# EasyEDA Pro project ProPrj_HEMY 2.0_2025-04-23.epro, board HEMY Brake Driver 1.1
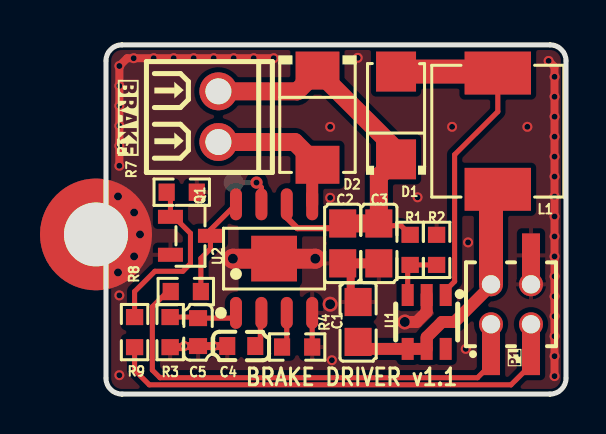
[diagram p6: board, top side]
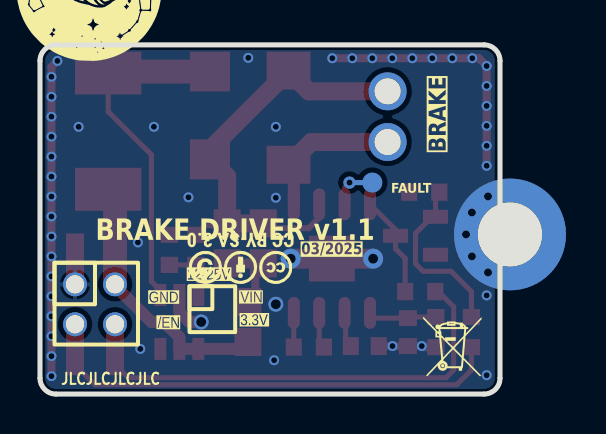
[diagram p7: board, bottom side, seen from below]

Outline 23 x 17.5 mm; copper layers: Top Layer, Bottom Layer. Coordinates in mm from the lower left corner of the outline.
Outline path: 0,16.7 0,0.8 arc(0.23,0.23) 0.8,0 22.2,0 arc(22.77,0.23) 23,0.8 23,16.7 arc(22.77,17.27) 22.2,17.5 0.8,17.5 arc(0.23,17.27) 0,16.7
Stack: Top Layer 0.035mm / Dielectric1 0.71mm FR4 er 4.5 / Bottom Layer 0.035mm

## Design rules (mm)
template: Custom Config
spacing copperThickness1oz (default): track to track 0.102, other pairs 0.15 to 0.3
spacing copperThickness2oz: track to track 0.203, other pairs 0.152 to 0.3
track width copperThickness1oz (default): min 0.127, default 0.254, max 2.54
track width copperThickness2oz: min 0.203, default 0.254, max 2.54
differential pair differentialPair (default): width min 0.127, default 0.254, max 2.54; gap min 0.152, default 0.152
via viaSize (default): diameter min 0.5, default 0.61, max 10; hole min 0.25, default 0.305, max 6.3

## Placement (name value [footprint] x y rotation side)
C1  22uF  [C0805]  12.6 3.61 270 top
C2  100nF  [C0805]  11.84 7.55 270 top
C3  22uF  [C0805]  13.64 7.55 90 top
C4  100nF  [C0603]  6.76 2.41 0 top
C5  100pF  [C0603]  4.6 3.11 90 top
D1  SS34  [SMA_L4.3-W2.6-LS5.2-RD]  14.5 13.96 90 top
D2  ES3DB  [SMB_L4.6-W3.6-LS5.3-RD]  10.57 13.85 270 top
FAULT  -  [Test-Point-0.5mm]  6.38 10.6 180 bottom
L1  22uH  [IND-SMD_L7.1-W6.6]  19.59 13.17 90 top
NOREF  -  [Pad_e8820]  -0.5 8 0 top
P1  -  [62100421821]  20.25 4.5 0 top
P3  MX128-2.54-02P  [CONN-TH_2P-P2.54_MX128-2.54-GN01-02P-CU-Y-A]  5.62 13.9 270 top
Q1  MMBT3904  [SOT-23-3_L2.9-W1.3-P1.90-LS2.4-BR]  4.22 7.93 180 top
R1  82kΩ  [R0603]  15.21 7.23 270 top
R2  2.2kΩ  [R0603]  16.53 7.23 270 top
R3  33kΩ  [R0603]  3.21 3.11 90 top
R4  47kΩ  [R0603]  9.56 2.36 180 top
R7  4.7kΩ  [R0603]  3.79 10.12 180 top
R8  4.7kΩ  [R0603]  3.99 5.14 180 top
R9  4.7kΩ  [R0603]  1.43 3.11 90 top
U1  SDB628  [SOT-23-6_L2.9-W1.6-P0.95-LS2.8-BR]  16.03 3.61 90 top
U2  DRV103H/2K5  [SOIC-8_L4.9-W3.9-P1.27-LS6.0-BL-EP2.3]  8.4 6.79 0 top

## Footprints (pads in the part's own frame, mm; a bottom-side part is the same pattern mirrored in y, then rotated)
62100421821
  round 1.2 hole 0.914x0.85: 1(-1,-1) 2(-1,1) 3(1,-1) 4(1,1)
  rect 0.9x2.2 smd: 1(-1,-2.45) 2(-1,2.45) 3(1,-2.45) 4(1,2.45)
C0603
  rect 0.8x0.9 smd: 1(-0.7,0) 2(0.7,0)
C0805
  rect 1.41x1.35 smd: 1(-1,0) 2(1,0)
CONN-TH_2P-P2.54_MX128-2.54-GN01-02P-CU-Y-A
  round 1.9 hole 1.3: 1(-1.27,0) 2(1.27,0)
IND-SMD_L7.1-W6.6
  rect 2.15x3.32 smd: 1(-2.913,0) 2(2.913,0)
Pad_e8820
  round 5.6 hole 3.2: 1(0,0)
R0603
  rect 0.806x0.864 smd: 1(-0.753,0) 2(0.753,0)
SMA_L4.3-W2.6-LS5.2-RD
  rect 2x2 smd: 1(-2.2,0) 2(2.2,0)
SMB_L4.6-W3.6-LS5.3-RD
  rect 1.9x2.192 smd: 1(-2.361,0) 2(2.361,0)
SOIC-8_L4.9-W3.9-P1.27-LS6.0-BL-EP2.3
  oval 0.6x1.6 smd: 1(-1.905,-2.72) 2(-0.635,-2.72) 3(0.635,-2.72) 4(1.905,-2.72) 5(1.905,2.72) 6(0.635,2.72) 7(-0.635,2.72) 8(-1.905,2.72)
  rect 2.29x2.29 smd: 9(0,0)
SOT-23-3_L2.9-W1.3-P1.90-LS2.4-BR
  rect 1.25x0.7 smd: 1(1,-0.95) 2(1,0.95) 3(-1,0)
SOT-23-6_L2.9-W1.6-P0.95-LS2.8-BR
  rect 1.1x0.6 smd: 1(1.35,-0.95) 2(1.35,0) 3(1.35,0.95) 4(-1.35,0.95) 5(-1.35,0) 6(-1.35,-0.95)
Test-Point-0.5mm
  round 1 smd: 1(0,0)

## Nets
As in the schematic, except:
GND: C1.1 C2.2 C3.1 C4.1 C5.1 NOREF.1 P1.4 Q1.2 R2.1 R3.1 R4.1 R7.1 U1.2 U2.4 U2.9
$1N4182: D2.2 P3.2 U2.5

Pads without a net: U1 6

## Via types
v1: diameter 0.5, hole 0.3, Top Layer to Bottom Layer, 44 vias
v2: diameter 0.75, hole 0.5, Top Layer to Bottom Layer, 2 vias
v3: diameter 0.5, hole 0.4, Top Layer to Bottom Layer, 5 vias
v4: diameter 1, hole 0.5, Top Layer to Bottom Layer, 2 vias
v5: diameter 0.61, hole 0.305, Top Layer to Bottom Layer, 1 via

## Routing (per net, layer and track width the routed paths; a pad name or vN(x,y) marks a point on that pad's centre or on a via; arc(x,y) is an arc through that point)
3.3V: length 22.3
  Top Layer w0.254: P1.1 19.25,1.5 18.57,0.82 2.7,0.82 2.32,1.2 2.32,4.38 3.08,5.14 R8.2
24V: length 22.4
  Top Layer w0.254: R1.1 14.75,8.44 13.75,8.44 C3.2
  Top Layer w0.3: C2.1 11.6,8.31 9.57,8.31 9.04,8.84 U2.6
  Top Layer w0.9: 10.57,16.19 9.56,15.17 5.62,15.17 ; 10.57,16.19 14.5,12.26 14.5,11.76 13.64,10.9 C3.2 C2.1 ; 10.57,16.19 D2.1
GND: length 43.9
  Top Layer w0.254: 10.31,2.36 U2.4
  Top Layer w0.4: C5.1 6.06,2.41 ; 4.6,2.41 v1(3.91,2.41) 3.86,2.35 R3.1 ; v1(0.67,11.44) v1(0.67,12.44) v1(0.67,13.44) v1(0.67,14.44) v1(0.67,15.44) v1(0.67,16.44) 1.06,16.83 v1(1.38,16.83) v1(2.38,16.83) v1(3.38,16.83) v1(4.38,16.83) v1(5.38,16.83) v1(6.38,16.83) v1(7.38,16.83) v1(8.38,16.83) ; C1.1 12.49,4.73 12.24,4.73 12.24,6.15 C2.2 ; v1(22.13,16.69) 22.43,16.4 v1(22.43,15.9) v1(22.43,14.9) v1(22.43,13.9) v1(22.43,12.9) v1(22.43,11.9) v1(22.43,10.9) v1(22.43,9.9) v1(22.43,8.9) v1(22.43,7.9) v1(22.43,6.9) v1(22.43,5.9) v1(22.43,4.9) v1(22.43,3.9) v1(22.43,2.9) v1(22.43,1.9) v1(22.43,0.9)
  Top Layer w0.5: C2.2 C3.1
  Top Layer w0.6: U1.2 16.03,4.12 15.53,3.61 v2(14.94,3.61)
  Top Layer w1: v4(6.34,6.78) v4(10.46,6.78)
  vias: v1(0.67,4.95) v1(0.67,0.95) v1(5.38,2.41) v1(11.21,13.39) v1(11.21,9.84) v1(11.29,1.7) v1(12.59,16.85) v1(15.58,9.86) v1(17.3,13.39) v1(17.99,2.26) v1(18.1,7.6) v1(21.07,13.39) v2(11.21,4.5) v3(0.6,9.91) v3(0.6,6.09) v3(1.41,9.1) v3(1.41,6.9) v3(1.7,8)
VIN: length 13.1
  Top Layer w0.6: 19.25,5.43 17.43,3.61 16.8,3.61 16.03,2.85 U1.5 U1.4 12.96,2.26 C1.2
  Top Layer w1.2: L1.1 19.25,9.92 P1.2 19.25,5.7
M1_ENA: length 22.3
  Top Layer w0.254: P1.3 21.25,1.46 20.25,0.46 2.17,0.46 1.43,1.2 R9.1
$1N4023: length 1.8
  Top Layer w0.254: U2.3 9.04,2.59 R4.2
$1N4066: length 3.4
  Top Layer w0.254: R3.2 4.55,3.86 C5.2 6.24,3.81 U2.1
$1N4182: length 7.5
  Top Layer w0.6: U2.5 10.31,11.23 D2.2
  Top Layer w0.9: P3.2 9.43,12.63 D2.2
$1N4441: length 5.1
  Top Layer w0.254: R8.1 4.74,6.8 5.22,7.28 Q1.3 5.22,8.23 U2.8
$1N5858: length 17.3
  Top Layer w0.254: U1.1 16.98,5.2 17.43,5.65 17.43,12 19.59,14.16 L1.2
  Top Layer w1.2: 14.5,16.16 19.51,16.16 L1.2
$1N9857: length 2.9
  Top Layer w0.254: R2.2 R1.2 15.08,6.35 U1.3
$1N10088: length 1.8
  Top Layer w0.254: U2.2 7.72,4.02 7.72,2.66 C4.2
$1N16383: length 2.3
  Top Layer w0.254: v5(7.53,10.6) 7.77,10.36 U2.7
  Bottom Layer w0.254: v5(7.53,10.6) FAULT.1
$1N19329: length 8.8
  Top Layer w0.254: 3.03,10.12 3.22,9.93 Q1.1 3.4,8.88 4.22,8.06 4.22,6.53 3.84,6.15 2.44,6.15 1.43,5.14 R9.2

## Copper pours and planes (outline as drawn; the poured copper is in the pictures)
GND on Top Layer: -0.98,17.84 24.67,17.84 24.67,-0.2 -0.98,-0.2
GND on Bottom Layer: -0.98,17.84 24.67,17.84 24.67,-0.2 -0.98,-0.2

## Text on the board
Bottom Silkscreen Layer: JLCJLCJLCJLC | 03/2025 | BRAKE | BRAKE DRIVER v1.1 | VIN | 12-25V | GND | 3.3V | /EN
Document Layer: Order this part in your JLC inventory: / WR-PHD SMT 62100421821
Top Silkscreen Layer: BRAKE DRIVER v1.1 | BRAKE
